# EAGLE schematic clock (EAGLE 6.2)
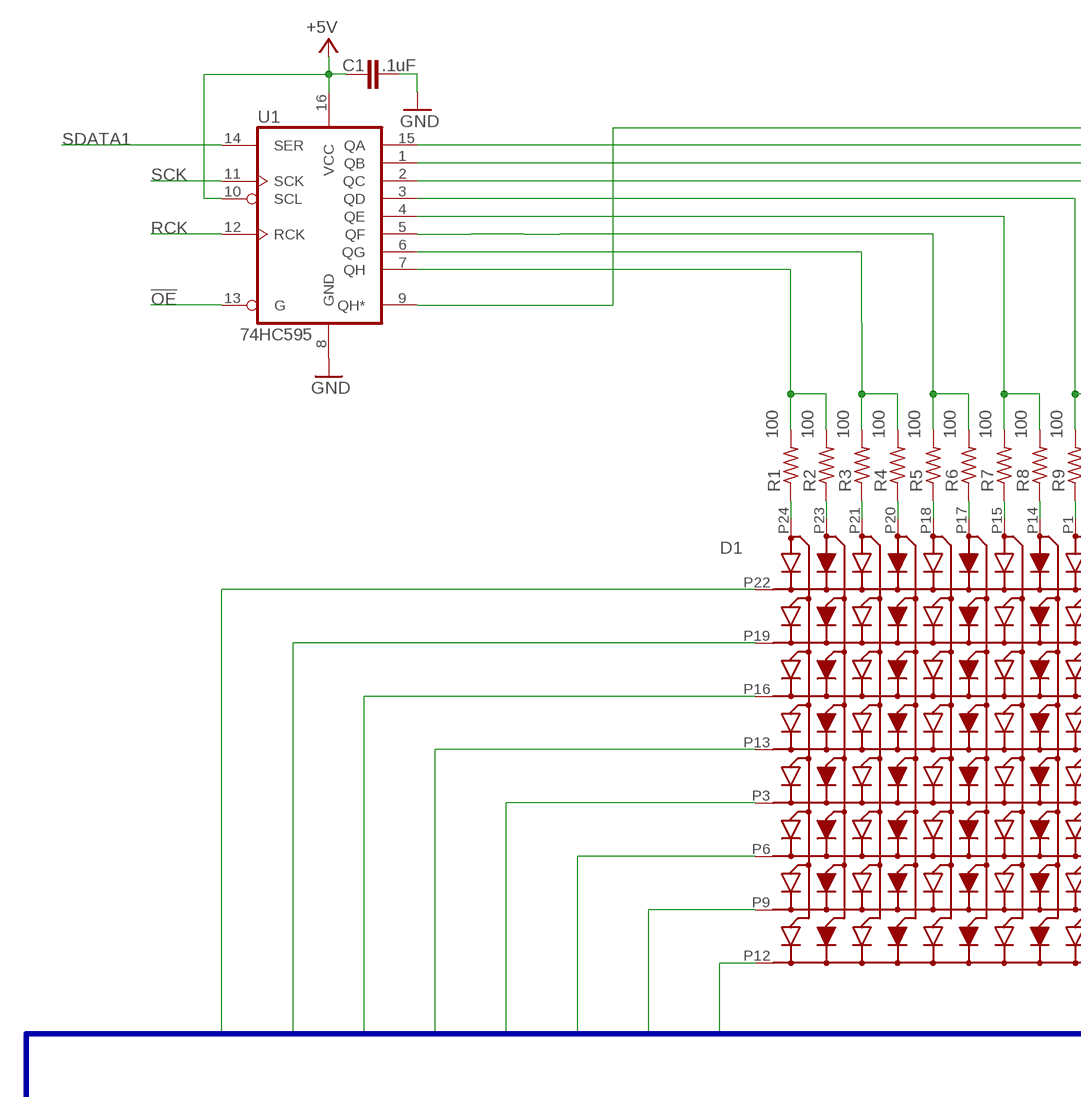
[diagram p0: schematic, sheet 1, part 1 of 3]
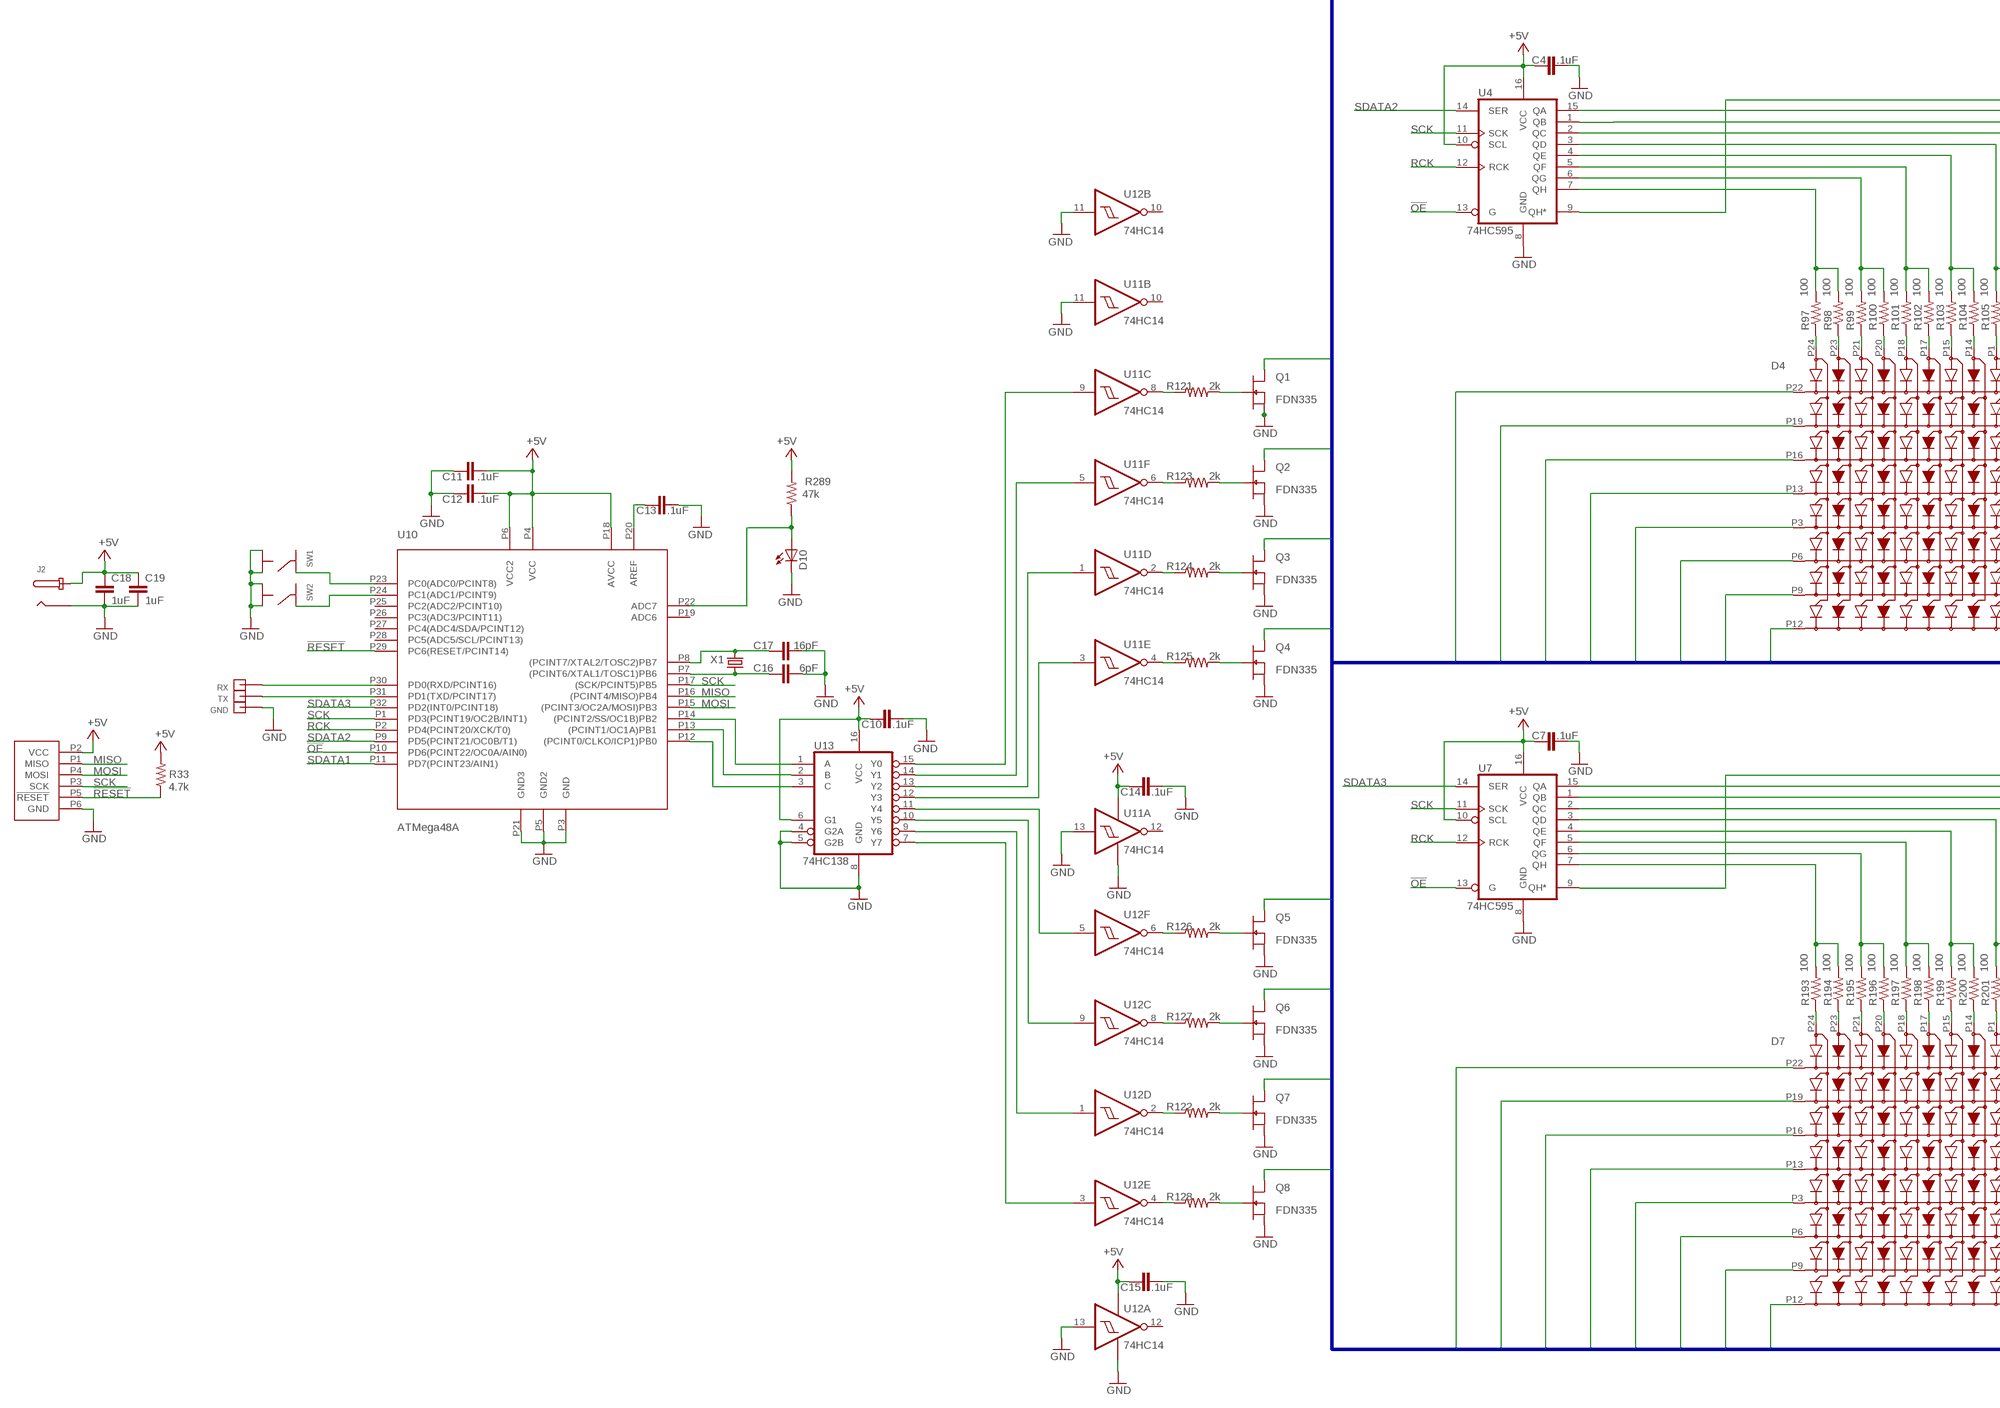
[diagram p1: schematic, sheet 1, part 2 of 3]
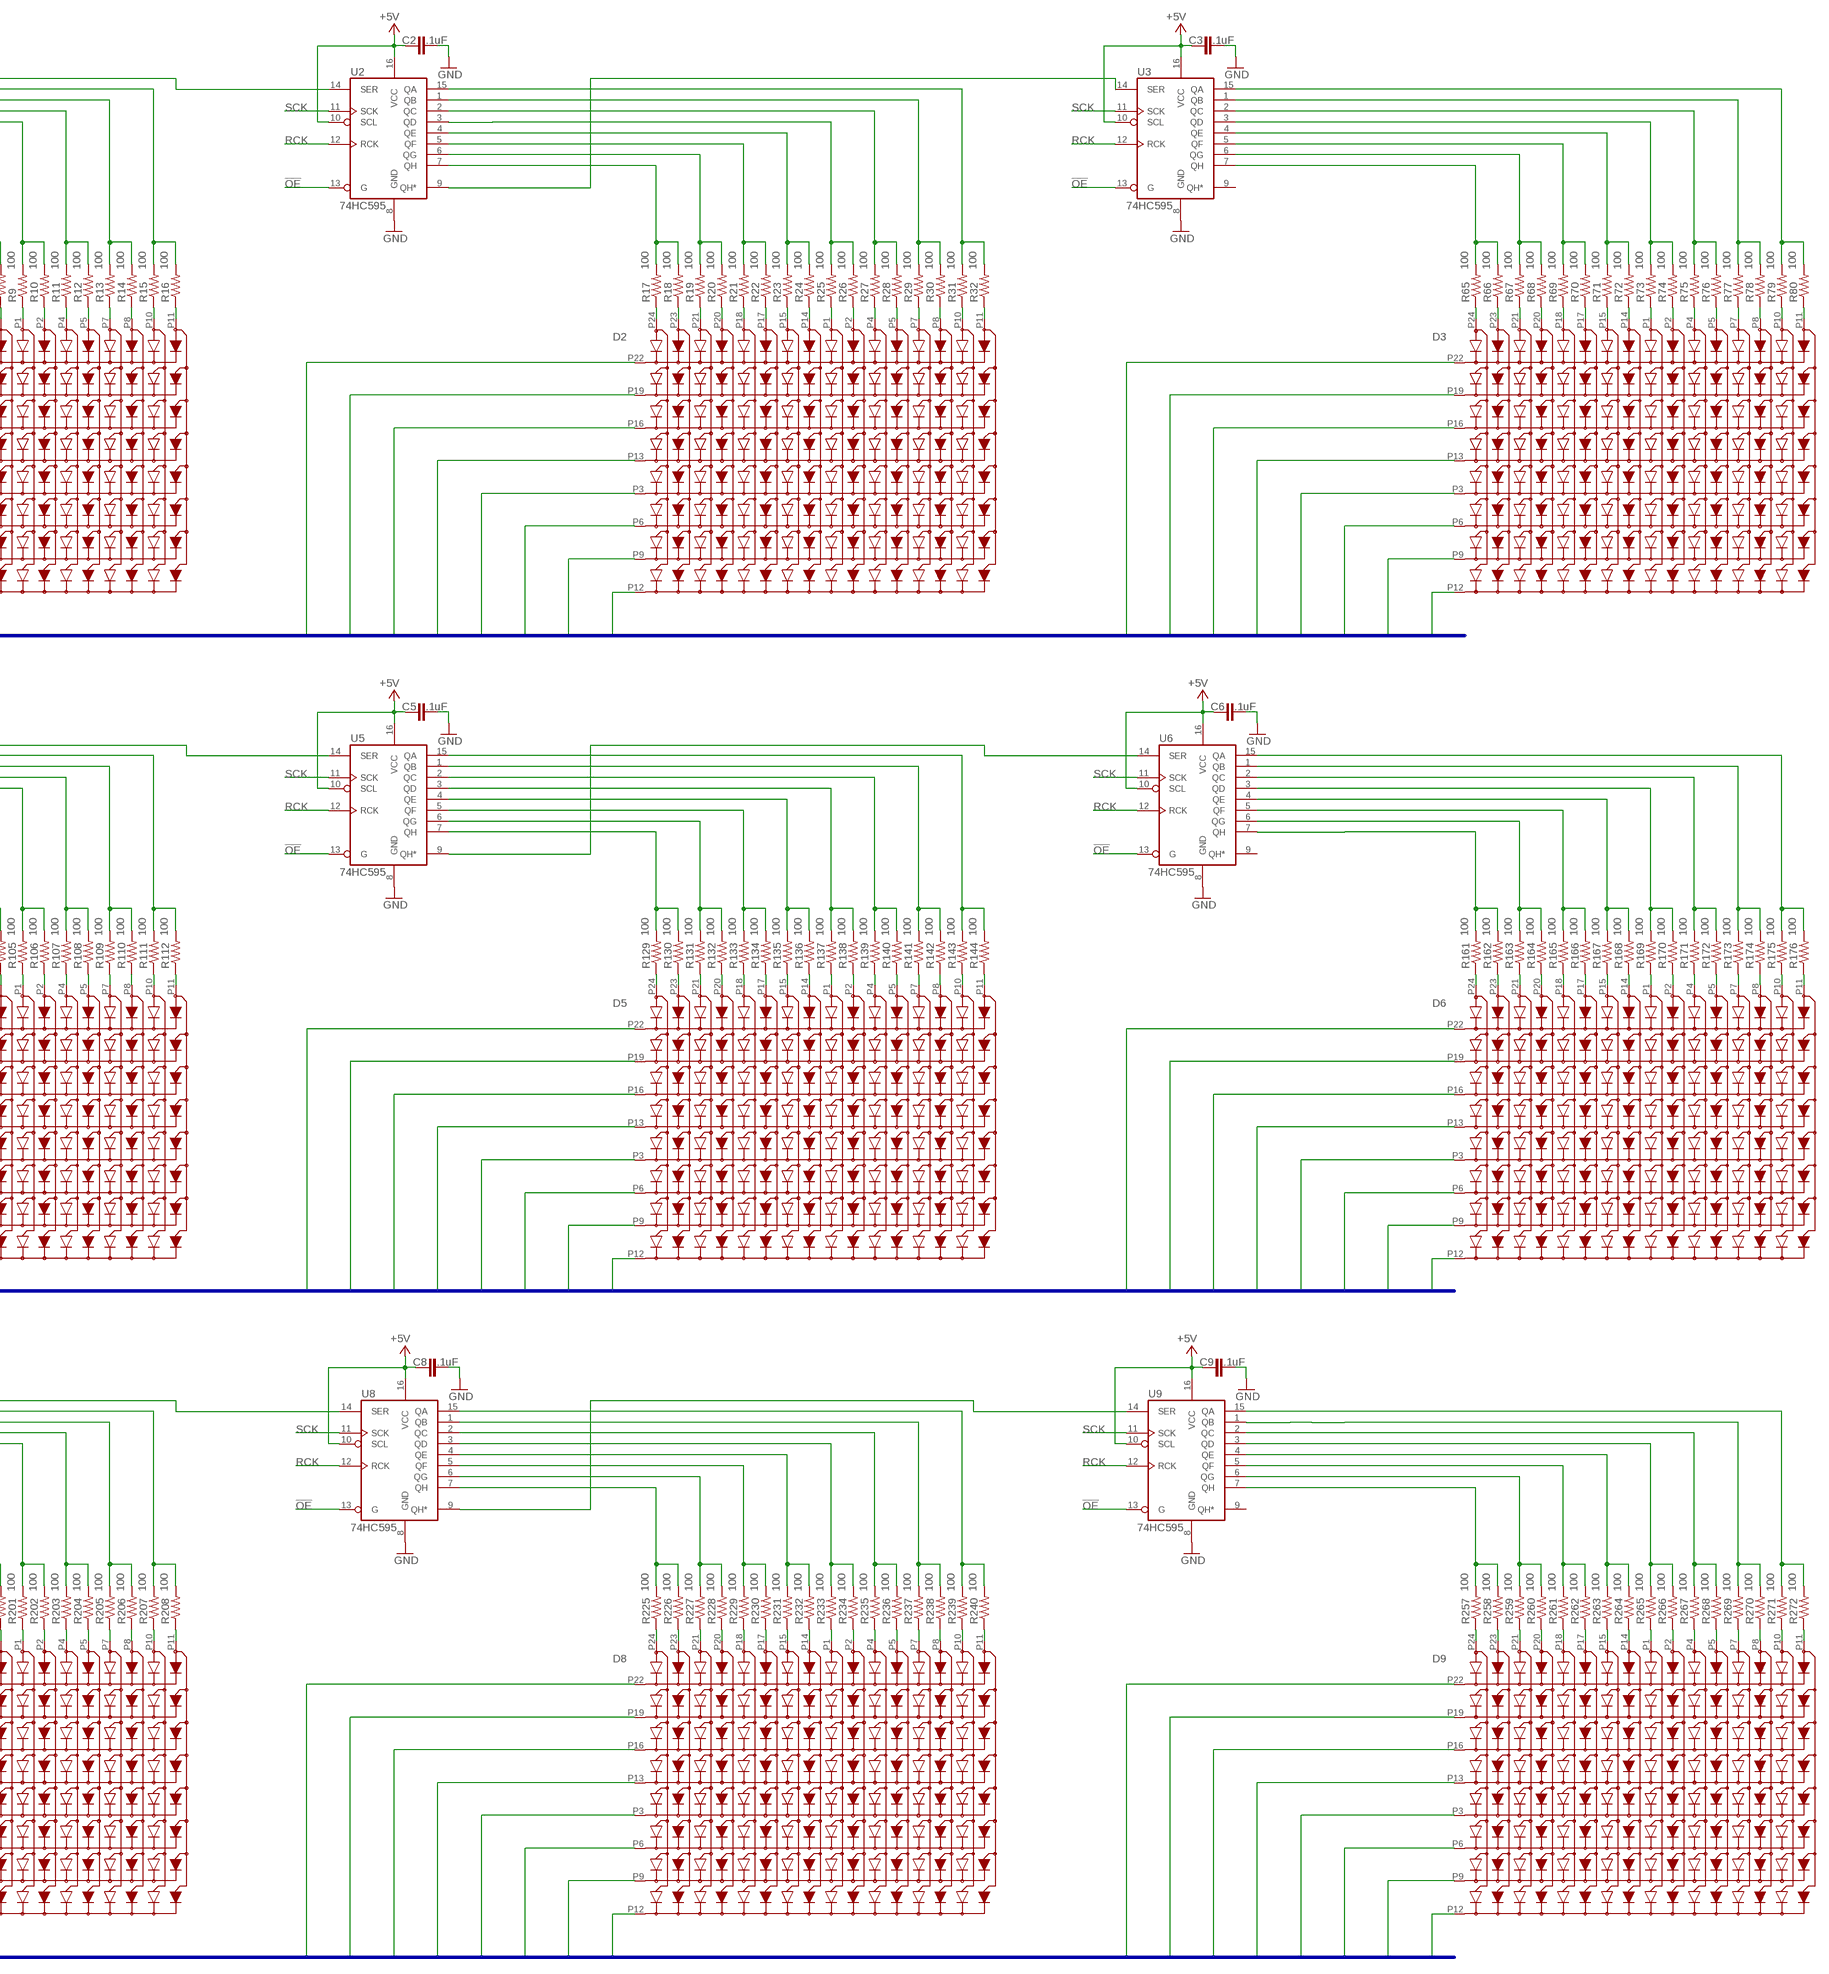
[diagram p2: schematic, sheet 1, part 3 of 3]

## Parts
C1  .1uF  CAPACITOR-.1UF  [0603/1608METRIC]
C2  .1uF  CAPACITOR-.1UF  [0603/1608METRIC]
C3  .1uF  CAPACITOR-.1UF  [0603/1608METRIC]
C4  .1uF  CAPACITOR-.1UF  [0603/1608METRIC]
C5  .1uF  CAPACITOR-.1UF  [0603/1608METRIC]
C6  .1uF  CAPACITOR-.1UF  [0603/1608METRIC]
C7  .1uF  CAPACITOR-.1UF  [0603/1608METRIC]
C8  .1uF  CAPACITOR-.1UF  [0603/1608METRIC]
C9  .1uF  CAPACITOR-.1UF  [0603/1608METRIC]
C10  .1uF  CAPACITOR-.1UF  [0603/1608METRIC]
C11  .1uF  CAPACITOR-.1UF  [0603/1608METRIC]
C12  .1uF  CAPACITOR-.1UF  [0603/1608METRIC]
C13  .1uF  CAPACITOR-.1UF  [0603/1608METRIC]
C14  .1uF  CAPACITOR-.1UF  [0603/1608METRIC]
C15  .1uF  CAPACITOR-.1UF  [0603/1608METRIC]
C16  6pF  CAPACITOR-6PF  [0603/1608METRIC]
C17  16pF  CAPACITOR-16PF  [0603/1608METRIC]
C18  1uF  CAPACITOR-1UF  [0603/1608METRIC]
C19  1uF  CAPACITOR-1UF  [0603/1608METRIC]
D1  BL-M12A883DUG-11"  [BL-M12A883DUG-11]
D2  BL-M12A883DUG-11"  [BL-M12A883DUG-11]
D3  BL-M12A883DUG-11"  [BL-M12A883DUG-11]
D4  BL-M12A883DUG-11"  [BL-M12A883DUG-11]
D5  BL-M12A883DUG-11"  [BL-M12A883DUG-11]
D6  BL-M12A883DUG-11"  [BL-M12A883DUG-11]
D7  BL-M12A883DUG-11"  [BL-M12A883DUG-11]
D8  BL-M12A883DUG-11"  [BL-M12A883DUG-11]
D9  BL-M12A883DUG-11"  [BL-M12A883DUG-11]
D10  TEPT4400  [LED3MM]
GND  HEADERPIN  [HEADERPIN]
J1  PROGHEADER-PINS  [ATMEL-PROGRAMMING-HEADER]
J2  DC-BARREL-JACK  [PJ-037A]
Q1  FDN335  [SOT23]
Q2  FDN335  [SOT23]
Q3  FDN335  [SOT23]
Q4  FDN335  [SOT23]
Q5  FDN335  [SOT23]
Q6  FDN335  [SOT23]
Q7  FDN335  [SOT23]
Q8  FDN335  [SOT23]
R1  100  RESISTOR-100-5%-0603  [0603/1608METRIC]
R2  100  RESISTOR-100-5%-0603  [0603/1608METRIC]
R3  100  RESISTOR-100-5%-0603  [0603/1608METRIC]
R4  100  RESISTOR-100-5%-0603  [0603/1608METRIC]
R5  100  RESISTOR-100-5%-0603  [0603/1608METRIC]
R6  100  RESISTOR-100-5%-0603  [0603/1608METRIC]
R7  100  RESISTOR-100-5%-0603  [0603/1608METRIC]
R8  100  RESISTOR-100-5%-0603  [0603/1608METRIC]
R9  100  RESISTOR-100-5%-0603  [0603/1608METRIC]
R10  100  RESISTOR-100-5%-0603  [0603/1608METRIC]
R11  100  RESISTOR-100-5%-0603  [0603/1608METRIC]
R12  100  RESISTOR-100-5%-0603  [0603/1608METRIC]
R13  100  RESISTOR-100-5%-0603  [0603/1608METRIC]
R14  100  RESISTOR-100-5%-0603  [0603/1608METRIC]
R15  100  RESISTOR-100-5%-0603  [0603/1608METRIC]
R16  100  RESISTOR-100-5%-0603  [0603/1608METRIC]
R17  100  RESISTOR-100-5%-0603  [0603/1608METRIC]
R18  100  RESISTOR-100-5%-0603  [0603/1608METRIC]
R19  100  RESISTOR-100-5%-0603  [0603/1608METRIC]
R20  100  RESISTOR-100-5%-0603  [0603/1608METRIC]
R21  100  RESISTOR-100-5%-0603  [0603/1608METRIC]
R22  100  RESISTOR-100-5%-0603  [0603/1608METRIC]
R23  100  RESISTOR-100-5%-0603  [0603/1608METRIC]
R24  100  RESISTOR-100-5%-0603  [0603/1608METRIC]
R25  100  RESISTOR-100-5%-0603  [0603/1608METRIC]
R26  100  RESISTOR-100-5%-0603  [0603/1608METRIC]
R27  100  RESISTOR-100-5%-0603  [0603/1608METRIC]
R28  100  RESISTOR-100-5%-0603  [0603/1608METRIC]
R29  100  RESISTOR-100-5%-0603  [0603/1608METRIC]
R30  100  RESISTOR-100-5%-0603  [0603/1608METRIC]
R31  100  RESISTOR-100-5%-0603  [0603/1608METRIC]
R32  100  RESISTOR-100-5%-0603  [0603/1608METRIC]
R33  4.7k  RESISTOR-4.7K-5%-0603  [0603/1608METRIC]
R65  100  RESISTOR-100-5%-0603  [0603/1608METRIC]
R66  100  RESISTOR-100-5%-0603  [0603/1608METRIC]
R67  100  RESISTOR-100-5%-0603  [0603/1608METRIC]
R68  100  RESISTOR-100-5%-0603  [0603/1608METRIC]
R69  100  RESISTOR-100-5%-0603  [0603/1608METRIC]
R70  100  RESISTOR-100-5%-0603  [0603/1608METRIC]
R71  100  RESISTOR-100-5%-0603  [0603/1608METRIC]
R72  100  RESISTOR-100-5%-0603  [0603/1608METRIC]
R73  100  RESISTOR-100-5%-0603  [0603/1608METRIC]
R74  100  RESISTOR-100-5%-0603  [0603/1608METRIC]
R75  100  RESISTOR-100-5%-0603  [0603/1608METRIC]
R76  100  RESISTOR-100-5%-0603  [0603/1608METRIC]
R77  100  RESISTOR-100-5%-0603  [0603/1608METRIC]
R78  100  RESISTOR-100-5%-0603  [0603/1608METRIC]
R79  100  RESISTOR-100-5%-0603  [0603/1608METRIC]
R80  100  RESISTOR-100-5%-0603  [0603/1608METRIC]
R97  100  RESISTOR-100-5%-0603  [0603/1608METRIC]
R98  100  RESISTOR-100-5%-0603  [0603/1608METRIC]
R99  100  RESISTOR-100-5%-0603  [0603/1608METRIC]
R100  100  RESISTOR-100-5%-0603  [0603/1608METRIC]
R101  100  RESISTOR-100-5%-0603  [0603/1608METRIC]
R102  100  RESISTOR-100-5%-0603  [0603/1608METRIC]
R103  100  RESISTOR-100-5%-0603  [0603/1608METRIC]
R104  100  RESISTOR-100-5%-0603  [0603/1608METRIC]
R105  100  RESISTOR-100-5%-0603  [0603/1608METRIC]
R106  100  RESISTOR-100-5%-0603  [0603/1608METRIC]
R107  100  RESISTOR-100-5%-0603  [0603/1608METRIC]
R108  100  RESISTOR-100-5%-0603  [0603/1608METRIC]
R109  100  RESISTOR-100-5%-0603  [0603/1608METRIC]
R110  100  RESISTOR-100-5%-0603  [0603/1608METRIC]
R111  100  RESISTOR-100-5%-0603  [0603/1608METRIC]
R112  100  RESISTOR-100-5%-0603  [0603/1608METRIC]
R121  2k  RESISTOR-2K-5%-0603  [0603/1608METRIC]
R122  2k  RESISTOR-2K-5%-0603  [0603/1608METRIC]
R123  2k  RESISTOR-2K-5%-0603  [0603/1608METRIC]
R124  2k  RESISTOR-2K-5%-0603  [0603/1608METRIC]
R125  2k  RESISTOR-2K-5%-0603  [0603/1608METRIC]
R126  2k  RESISTOR-2K-5%-0603  [0603/1608METRIC]
R127  2k  RESISTOR-2K-5%-0603  [0603/1608METRIC]
R128  2k  RESISTOR-2K-5%-0603  [0603/1608METRIC]
R129  100  RESISTOR-100-5%-0603  [0603/1608METRIC]
R130  100  RESISTOR-100-5%-0603  [0603/1608METRIC]
R131  100  RESISTOR-100-5%-0603  [0603/1608METRIC]
R132  100  RESISTOR-100-5%-0603  [0603/1608METRIC]
R133  100  RESISTOR-100-5%-0603  [0603/1608METRIC]
R134  100  RESISTOR-100-5%-0603  [0603/1608METRIC]
R135  100  RESISTOR-100-5%-0603  [0603/1608METRIC]
R136  100  RESISTOR-100-5%-0603  [0603/1608METRIC]
R137  100  RESISTOR-100-5%-0603  [0603/1608METRIC]
R138  100  RESISTOR-100-5%-0603  [0603/1608METRIC]
R139  100  RESISTOR-100-5%-0603  [0603/1608METRIC]
R140  100  RESISTOR-100-5%-0603  [0603/1608METRIC]
R141  100  RESISTOR-100-5%-0603  [0603/1608METRIC]
R142  100  RESISTOR-100-5%-0603  [0603/1608METRIC]
R143  100  RESISTOR-100-5%-0603  [0603/1608METRIC]
R144  100  RESISTOR-100-5%-0603  [0603/1608METRIC]
R161  100  RESISTOR-100-5%-0603  [0603/1608METRIC]
R162  100  RESISTOR-100-5%-0603  [0603/1608METRIC]
R163  100  RESISTOR-100-5%-0603  [0603/1608METRIC]
R164  100  RESISTOR-100-5%-0603  [0603/1608METRIC]
R165  100  RESISTOR-100-5%-0603  [0603/1608METRIC]
R166  100  RESISTOR-100-5%-0603  [0603/1608METRIC]
R167  100  RESISTOR-100-5%-0603  [0603/1608METRIC]
R168  100  RESISTOR-100-5%-0603  [0603/1608METRIC]
R169  100  RESISTOR-100-5%-0603  [0603/1608METRIC]
R170  100  RESISTOR-100-5%-0603  [0603/1608METRIC]
R171  100  RESISTOR-100-5%-0603  [0603/1608METRIC]
R172  100  RESISTOR-100-5%-0603  [0603/1608METRIC]
R173  100  RESISTOR-100-5%-0603  [0603/1608METRIC]
R174  100  RESISTOR-100-5%-0603  [0603/1608METRIC]
R175  100  RESISTOR-100-5%-0603  [0603/1608METRIC]
R176  100  RESISTOR-100-5%-0603  [0603/1608METRIC]
R193  100  RESISTOR-100-5%-0603  [0603/1608METRIC]
R194  100  RESISTOR-100-5%-0603  [0603/1608METRIC]
R195  100  RESISTOR-100-5%-0603  [0603/1608METRIC]
R196  100  RESISTOR-100-5%-0603  [0603/1608METRIC]
R197  100  RESISTOR-100-5%-0603  [0603/1608METRIC]
R198  100  RESISTOR-100-5%-0603  [0603/1608METRIC]
R199  100  RESISTOR-100-5%-0603  [0603/1608METRIC]
R200  100  RESISTOR-100-5%-0603  [0603/1608METRIC]
R201  100  RESISTOR-100-5%-0603  [0603/1608METRIC]
R202  100  RESISTOR-100-5%-0603  [0603/1608METRIC]
R203  100  RESISTOR-100-5%-0603  [0603/1608METRIC]
R204  100  RESISTOR-100-5%-0603  [0603/1608METRIC]
R205  100  RESISTOR-100-5%-0603  [0603/1608METRIC]
R206  100  RESISTOR-100-5%-0603  [0603/1608METRIC]
R207  100  RESISTOR-100-5%-0603  [0603/1608METRIC]
R208  100  RESISTOR-100-5%-0603  [0603/1608METRIC]
R225  100  RESISTOR-100-5%-0603  [0603/1608METRIC]
R226  100  RESISTOR-100-5%-0603  [0603/1608METRIC]
R227  100  RESISTOR-100-5%-0603  [0603/1608METRIC]
R228  100  RESISTOR-100-5%-0603  [0603/1608METRIC]
R229  100  RESISTOR-100-5%-0603  [0603/1608METRIC]
R230  100  RESISTOR-100-5%-0603  [0603/1608METRIC]
R231  100  RESISTOR-100-5%-0603  [0603/1608METRIC]
R232  100  RESISTOR-100-5%-0603  [0603/1608METRIC]
R233  100  RESISTOR-100-5%-0603  [0603/1608METRIC]
R234  100  RESISTOR-100-5%-0603  [0603/1608METRIC]
R235  100  RESISTOR-100-5%-0603  [0603/1608METRIC]
R236  100  RESISTOR-100-5%-0603  [0603/1608METRIC]
R237  100  RESISTOR-100-5%-0603  [0603/1608METRIC]
R238  100  RESISTOR-100-5%-0603  [0603/1608METRIC]
R239  100  RESISTOR-100-5%-0603  [0603/1608METRIC]
R240  100  RESISTOR-100-5%-0603  [0603/1608METRIC]
R257  100  RESISTOR-100-5%-0603  [0603/1608METRIC]
R258  100  RESISTOR-100-5%-0603  [0603/1608METRIC]
R259  100  RESISTOR-100-5%-0603  [0603/1608METRIC]
R260  100  RESISTOR-100-5%-0603  [0603/1608METRIC]
R261  100  RESISTOR-100-5%-0603  [0603/1608METRIC]
R262  100  RESISTOR-100-5%-0603  [0603/1608METRIC]
R263  100  RESISTOR-100-5%-0603  [0603/1608METRIC]
R264  100  RESISTOR-100-5%-0603  [0603/1608METRIC]
R265  100  RESISTOR-100-5%-0603  [0603/1608METRIC]
R266  100  RESISTOR-100-5%-0603  [0603/1608METRIC]
R267  100  RESISTOR-100-5%-0603  [0603/1608METRIC]
R268  100  RESISTOR-100-5%-0603  [0603/1608METRIC]
R269  100  RESISTOR-100-5%-0603  [0603/1608METRIC]
R270  100  RESISTOR-100-5%-0603  [0603/1608METRIC]
R271  100  RESISTOR-100-5%-0603  [0603/1608METRIC]
R272  100  RESISTOR-100-5%-0603  [0603/1608METRIC]
R289  47k  RESISTOR-47K-5%-0603  [0603/1608METRIC]
RX  HEADERPIN  [HEADERPIN]
SW1  4mm  SWITCH-TACT-TH  [FSM16JHSWITCH]
SW2  4mm  SWITCH-TACT-TH  [FSM16JHSWITCH]
TX  HEADERPIN  [HEADERPIN]
U1  74HC595  74HC595-SOIC  [SO16]
U2  74HC595  74HC595-SOIC  [SO16]
U3  74HC595  74HC595-SOIC  [SO16]
U4  74HC595  74HC595-SOIC  [SO16]
U5  74HC595  74HC595-SOIC  [SO16]
U6  74HC595  74HC595-SOIC  [SO16]
U7  74HC595  74HC595-SOIC  [SO16]
U8  74HC595  74HC595-SOIC  [SO16]
U9  74HC595  74HC595-SOIC  [SO16]
U10  ATMega48A  ATMEGA48A  [TQFP-32]
U11  74HC14  74HC14-SOIC  [SO14]
U12  74HC14  74HC14-SOIC  [SO14]
U13  74HC138  74HC138-SOIC  [SO16]
X1  XTAL  [AB38T]

## Nets
!OE: U1.13(G) U2.13(G) U3.13(G) U4.13(G) U5.13(G) U6.13(G) U7.13(G) U8.13(G) U9.13(G) U10.P10(PD6(PCINT22/OC0A/AIN0))
!RESET: J1.P5(!RESET) R33.P1 U10.P29(PC6(RESET/PCINT14))
+5V: C1.P1 C2.P1 C3.P1 C4.P1 C5.P1 C6.P1 C7.P1 C8.P1 C9.P1 C10.P1 C11.P1 C12.P1 C14.P1 C15.P1 C18.P1 C19.P1 J1.P2(VCC) J2.PIN R33.P2 R289.P2 U1.10(SCL) U1.16(VCC) U2.10(SCL) U2.16(VCC) U3.10(SCL) U3.16(VCC) U4.10(SCL) U4.16(VCC) U5.10(SCL) U5.16(VCC) U6.10(SCL) U6.16(VCC) U7.10(SCL) U7.16(VCC) U8.10(SCL) U8.16(VCC) U9.10(SCL) U9.16(VCC) U10.P4(VCC) U10.P6(VCC2) U10.P18(AVCC) U11.14(A:VCC) U12.14(A:VCC) U13.6(G1) U13.16(VCC)
GND: C1.P2 C2.P2 C3.P2 C4.P2 C5.P2 C6.P2 C7.P2 C8.P2 C9.P2 C10.P2 C11.P2 C12.P2 C13.P2 C14.P2 C15.P2 C16.P2 C17.P2 C18.P2 C19.P2 D10.K(C) GND.P$1 J1.P6(GND) J2.BARREL Q1.2(S) Q2.2(S) Q3.2(S) Q4.2(S) Q5.2(S) Q6.2(S) Q7.2(S) Q8.2(S) SW1.P3 SW1.P4 SW2.P3 SW2.P4 U1.8(GND) U2.8(GND) U3.8(GND) U4.8(GND) U5.8(GND) U6.8(GND) U7.8(GND) U8.8(GND) U9.8(GND) U10.P3(GND) U10.P5(GND2) U10.P21(GND3) U11.7(A:GND) U11.11(B:I) U11.13(A:I) U12.7(A:GND) U12.11(B:I) U12.13(A:I) U13.4(G2A) U13.5(G2B) U13.8(GND)
MISO: J1.P1(MISO) U10.P16((PCINT4/MISO)PB4)
MOSI: J1.P4(MOSI) U10.P15((PCINT3/OC2A/MOSI)PB3)
N$1: D1.P24(C1G) R1.P1
N$2: D1.P23(C1R) R2.P1
N$3: D1.P21(C2G) R3.P1
N$4: D1.P20(C2R) R4.P1
N$5: D1.P18(C3G) R5.P1
N$6: D1.P17(C3R) R6.P1
N$7: D1.P15(C4G) R7.P1
N$8: D1.P14(C4R) R8.P1
N$9: D1.P1(C5G) R9.P1
N$10: D1.P2(C5R) R10.P1
N$11: D1.P4(C6G) R11.P1
N$12: D1.P5(C6R) R12.P1
N$13: D1.P7(C7G) R13.P1
N$14: D1.P8(C7R) R14.P1
N$15: D1.P10(C8G) R15.P1
N$16: D1.P11(C8R) R16.P1
N$17: U11.9(C:I) U13.15(Y0)
N$18: D2.P24(C1G) R17.P1
N$19: D2.P23(C1R) R18.P1
N$20: D2.P21(C2G) R19.P1
N$21: D2.P20(C2R) R20.P1
N$22: D2.P18(C3G) R21.P1
N$23: D2.P17(C3R) R22.P1
N$24: D2.P15(C4G) R23.P1
N$25: D2.P14(C4R) R24.P1
N$26: D2.P1(C5G) R25.P1
N$27: D2.P2(C5R) R26.P1
N$28: D2.P4(C6G) R27.P1
N$29: D2.P5(C6R) R28.P1
N$30: D2.P7(C7G) R29.P1
N$31: D2.P8(C7R) R30.P1
N$32: D2.P10(C8G) R31.P1
N$33: R124.P1 U11.2(D:O)
N$34: R123.P1 U11.6(F:O)
N$35: R121.P1 U11.8(C:O)
N$36: R125.P1 U11.4(E:O)
N$37: R128.P1 U12.4(E:O)
N$38: R122.P1 U12.2(D:O)
N$39: R127.P1 U12.8(C:O)
N$40: R126.P1 U12.6(F:O)
N$41: C16.P1 U10.P7((PCINT6/XTAL1/TOSC1)PB6) X1.P$1
N$42: R3.P2 R4.P2 U1.6(QG)
N$43: TX.P$1 U10.P31(PD1(TXD/PCINT17))
N$44: C17.P1 U10.P8((PCINT7/XTAL2/TOSC2)PB7) X1.P$2
N$45: RX.P$1 U10.P30(PD0(RXD/PCINT16))
N$46: Q3.1(G) R124.P2
N$47: SW2.P2 U10.P24(PC1(ADC1/PCINT9))
N$48: SW1.P2 U10.P23(PC0(ADC0/PCINT8))
N$49: R1.P2 R2.P2 U1.7(QH)
N$50: Q1.1(G) R121.P2
N$51: R5.P2 R6.P2 U1.5(QF)
N$52: R7.P2 R8.P2 U1.4(QE)
N$53: R9.P2 R10.P2 U1.3(QD)
N$54: R11.P2 R12.P2 U1.2(QC)
N$55: R13.P2 R14.P2 U1.1(QB)
N$56: R15.P2 R16.P2 U1.15(QA)
N$74: U11.5(F:I) U13.14(Y1)
N$75: U4.9(QH*) U5.14(SER)
N$76: U5.9(QH*) U6.14(SER)
N$77: U11.1(D:I) U13.13(Y2)
N$78: U1.9(QH*) U2.14(SER)
N$79: U2.9(QH*) U3.14(SER)
N$80: D2.P11(C8R) R32.P1
N$84: R25.P2 R26.P2 U2.3(QD)
N$85: R23.P2 R24.P2 U2.4(QE)
N$87: R19.P2 R20.P2 U2.6(QG)
N$97: R17.P2 R18.P2 U2.7(QH)
N$99: R21.P2 R22.P2 U2.5(QF)
N$102: R27.P2 R28.P2 U2.2(QC)
N$103: R29.P2 R30.P2 U2.1(QB)
N$104: R31.P2 R32.P2 U2.15(QA)
N$121: U7.9(QH*) U8.14(SER)
N$122: U8.9(QH*) U9.14(SER)
N$123: U11.3(E:I) U13.12(Y3)
N$124: U12.5(F:I) U13.11(Y4)
N$125: U12.9(C:I) U13.10(Y5)
N$126: U12.1(D:I) U13.9(Y6)
N$127: U12.3(E:I) U13.7(Y7)
N$128: D10.A R289.P1 U10.P22(ADC7)
N$129: D3.P24(C1G) R65.P1
N$130: D3.P23(C1R) R66.P1
N$131: D3.P21(C2G) R67.P1
N$132: D3.P20(C2R) R68.P1
N$133: D3.P18(C3G) R69.P1
N$134: D3.P17(C3R) R70.P1
N$135: D3.P15(C4G) R71.P1
N$136: D3.P14(C4R) R72.P1
N$137: D3.P1(C5G) R73.P1
N$138: D3.P2(C5R) R74.P1
N$139: D3.P4(C6G) R75.P1
N$140: D3.P5(C6R) R76.P1
N$141: D3.P7(C7G) R77.P1
N$142: D3.P8(C7R) R78.P1
N$143: D3.P10(C8G) R79.P1
N$144: D3.P11(C8R) R80.P1
N$161: R65.P2 R66.P2 U3.7(QH)
N$162: R67.P2 R68.P2 U3.6(QG)
N$163: R69.P2 R70.P2 U3.5(QF)
N$164: R71.P2 R72.P2 U3.4(QE)
N$165: R73.P2 R74.P2 U3.3(QD)
N$166: R75.P2 R76.P2 U3.2(QC)
N$167: R77.P2 R78.P2 U3.1(QB)
N$168: R79.P2 R80.P2 U3.15(QA)
N$185: U10.P12((PCINT0/CLKO/ICP1)PB0) U13.3(C)
N$186: U10.P13((PCINT1/OC1A)PB1) U13.2(B)
N$187: U10.P14((PCINT2/SS/OC1B)PB2) U13.1(A)
N$188: C13.P1 U10.P20(AREF)
N$193: D4.P24(C1G) R97.P1
N$194: D4.P23(C1R) R98.P1
N$195: D4.P21(C2G) R99.P1
N$196: D4.P20(C2R) R100.P1
N$197: D4.P18(C3G) R101.P1
N$198: D4.P17(C3R) R102.P1
N$199: D4.P15(C4G) R103.P1
N$200: D4.P14(C4R) R104.P1
N$201: D4.P1(C5G) R105.P1
N$202: D4.P2(C5R) R106.P1
N$203: D4.P4(C6G) R107.P1
N$204: D4.P5(C6R) R108.P1
N$205: D4.P7(C7G) R109.P1
N$206: D4.P8(C7R) R110.P1
N$207: D4.P10(C8G) R111.P1
N$208: D4.P11(C8R) R112.P1
N$210: R109.P2 R110.P2 U4.1(QB)
N$225: R97.P2 R98.P2 U4.7(QH)
N$226: R99.P2 R100.P2 U4.6(QG)
N$227: R101.P2 R102.P2 U4.5(QF)
N$228: R103.P2 R104.P2 U4.4(QE)
N$229: R105.P2 R106.P2 U4.3(QD)
N$230: R107.P2 R108.P2 U4.2(QC)
N$232: R111.P2 R112.P2 U4.15(QA)
N$242: Q7.1(G) R122.P2
N$243: Q2.1(G) R123.P2
N$245: Q4.1(G) R125.P2
N$246: Q5.1(G) R126.P2
N$247: Q6.1(G) R127.P2
N$248: Q8.1(G) R128.P2
N$252: D5.P24(C1G) R129.P1
N$253: D5.P23(C1R) R130.P1
N$254: D5.P21(C2G) R131.P1
N$255: D5.P20(C2R) R132.P1
N$256: D5.P18(C3G) R133.P1
N$257: D5.P17(C3R) R134.P1
N$258: D5.P15(C4G) R135.P1
N$259: D5.P14(C4R) R136.P1
N$260: D5.P1(C5G) R137.P1
N$261: D5.P2(C5R) R138.P1
N$262: D5.P4(C6G) R139.P1
N$263: D5.P5(C6R) R140.P1
N$264: D5.P7(C7G) R141.P1
N$265: D5.P8(C7R) R142.P1
N$266: D5.P10(C8G) R143.P1
N$267: D5.P11(C8R) R144.P1
N$284: R129.P2 R130.P2 U5.7(QH)
N$285: R131.P2 R132.P2 U5.6(QG)
N$286: R133.P2 R134.P2 U5.5(QF)
N$287: R135.P2 R136.P2 U5.4(QE)
N$288: R137.P2 R138.P2 U5.3(QD)
N$289: R139.P2 R140.P2 U5.2(QC)
N$290: R141.P2 R142.P2 U5.1(QB)
N$291: R143.P2 R144.P2 U5.15(QA)
N$308: D6.P24(C1G) R161.P1
N$309: D6.P23(C1R) R162.P1
N$310: D6.P21(C2G) R163.P1
N$311: D6.P20(C2R) R164.P1
N$312: D6.P18(C3G) R165.P1
N$313: D6.P17(C3R) R166.P1
N$314: D6.P15(C4G) R167.P1
N$315: D6.P14(C4R) R168.P1
N$316: D6.P1(C5G) R169.P1
N$317: D6.P2(C5R) R170.P1
N$318: D6.P4(C6G) R171.P1
N$319: D6.P5(C6R) R172.P1
N$320: D6.P7(C7G) R173.P1
N$321: D6.P8(C7R) R174.P1
N$322: D6.P10(C8G) R175.P1
N$323: D6.P11(C8R) R176.P1
N$331: R161.P2 R162.P2 U6.7(QH)
N$341: R163.P2 R164.P2 U6.6(QG)
N$342: R165.P2 R166.P2 U6.5(QF)
N$343: R167.P2 R168.P2 U6.4(QE)
N$344: R169.P2 R170.P2 U6.3(QD)
N$345: R171.P2 R172.P2 U6.2(QC)
N$346: R173.P2 R174.P2 U6.1(QB)
N$347: R175.P2 R176.P2 U6.15(QA)
N$369: D7.P24(C1G) R193.P1
N$370: D7.P23(C1R) R194.P1
N$371: D7.P21(C2G) R195.P1
N$372: D7.P20(C2R) R196.P1
N$373: D7.P18(C3G) R197.P1
N$374: D7.P17(C3R) R198.P1
N$375: D7.P15(C4G) R199.P1
N$376: D7.P14(C4R) R200.P1
N$377: D7.P1(C5G) R201.P1
N$378: D7.P2(C5R) R202.P1
N$379: D7.P4(C6G) R203.P1
N$380: D7.P5(C6R) R204.P1
N$381: D7.P7(C7G) R205.P1
N$382: D7.P8(C7R) R206.P1
N$383: D7.P10(C8G) R207.P1
N$384: D7.P11(C8R) R208.P1
N$401: R193.P2 R194.P2 U7.7(QH)
N$402: R195.P2 R196.P2 U7.6(QG)
N$403: R197.P2 R198.P2 U7.5(QF)
N$404: R199.P2 R200.P2 U7.4(QE)
N$405: R201.P2 R202.P2 U7.3(QD)
N$406: R203.P2 R204.P2 U7.2(QC)
N$407: R205.P2 R206.P2 U7.1(QB)
N$408: R207.P2 R208.P2 U7.15(QA)
N$428: D8.P24(C1G) R225.P1
N$429: D8.P23(C1R) R226.P1
N$430: D8.P21(C2G) R227.P1
N$431: D8.P20(C2R) R228.P1
N$432: D8.P18(C3G) R229.P1
N$433: D8.P17(C3R) R230.P1
N$434: D8.P15(C4G) R231.P1
N$435: D8.P14(C4R) R232.P1
N$436: D8.P1(C5G) R233.P1
N$437: D8.P2(C5R) R234.P1
N$438: D8.P4(C6G) R235.P1
N$439: D8.P5(C6R) R236.P1
N$440: D8.P7(C7G) R237.P1
N$441: D8.P8(C7R) R238.P1
N$442: D8.P10(C8G) R239.P1
N$443: D8.P11(C8R) R240.P1
N$460: R225.P2 R226.P2 U8.7(QH)
N$461: R227.P2 R228.P2 U8.6(QG)
N$462: R229.P2 R230.P2 U8.5(QF)
N$463: R231.P2 R232.P2 U8.4(QE)
N$464: R233.P2 R234.P2 U8.3(QD)
N$465: R235.P2 R236.P2 U8.2(QC)
N$466: R237.P2 R238.P2 U8.1(QB)
N$467: R239.P2 R240.P2 U8.15(QA)
N$484: D9.P24(C1G) R257.P1
N$485: D9.P23(C1R) R258.P1
N$486: D9.P21(C2G) R259.P1
N$487: D9.P20(C2R) R260.P1
N$488: D9.P18(C3G) R261.P1
N$489: D9.P17(C3R) R262.P1
N$490: D9.P15(C4G) R263.P1
N$491: D9.P14(C4R) R264.P1
N$492: D9.P1(C5G) R265.P1
N$493: D9.P2(C5R) R266.P1
N$494: D9.P4(C6G) R267.P1
N$495: D9.P5(C6R) R268.P1
N$496: D9.P7(C7G) R269.P1
N$497: D9.P8(C7R) R270.P1
N$498: D9.P10(C8G) R271.P1
N$499: D9.P11(C8R) R272.P1
N$501: R269.P2 R270.P2 U9.1(QB)
N$516: R257.P2 R258.P2 U9.7(QH)
N$517: R259.P2 R260.P2 U9.6(QG)
N$518: R261.P2 R262.P2 U9.5(QF)
N$519: R263.P2 R264.P2 U9.4(QE)
N$520: R265.P2 R266.P2 U9.3(QD)
N$521: R267.P2 R268.P2 U9.2(QC)
N$523: R271.P2 R272.P2 U9.15(QA)
RCK: U1.12(RCK) U2.12(RCK) U3.12(RCK) U4.12(RCK) U5.12(RCK) U6.12(RCK) U7.12(RCK) U8.12(RCK) U9.12(RCK) U10.P2(PD4(PCINT20/XCK/T0))
ROW0: D1.P22(R1) D2.P22(R1) D3.P22(R1) D4.P22(R1) D5.P22(R1) D6.P22(R1) D7.P22(R1) D8.P22(R1) D9.P22(R1) Q1.3(D)
ROW1: D1.P19(R2) D2.P19(R2) D3.P19(R2) D4.P19(R2) D5.P19(R2) D6.P19(R2) D7.P19(R2) D8.P19(R2) D9.P19(R2) Q2.3(D)
ROW2: D1.P16(R3) D2.P16(R3) D3.P16(R3) D4.P16(R3) D5.P16(R3) D6.P16(R3) D7.P16(R3) D8.P16(R3) D9.P16(R3) Q3.3(D)
ROW3: D1.P13(R4) D2.P13(R4) D3.P13(R4) D4.P13(R4) D5.P13(R4) D6.P13(R4) D7.P13(R4) D8.P13(R4) D9.P13(R4) Q4.3(D)
ROW4: D1.P3(R5) D2.P3(R5) D3.P3(R5) D4.P3(R5) D5.P3(R5) D6.P3(R5) D7.P3(R5) D8.P3(R5) D9.P3(R5) Q5.3(D)
ROW5: D1.P6(R6) D2.P6(R6) D3.P6(R6) D4.P6(R6) D5.P6(R6) D6.P6(R6) D7.P6(R6) D8.P6(R6) D9.P6(R6) Q6.3(D)
ROW6: D1.P9(R7) D2.P9(R7) D3.P9(R7) D4.P9(R7) D5.P9(R7) D6.P9(R7) D7.P9(R7) D8.P9(R7) D9.P9(R7) Q7.3(D)
ROW7: D1.P12(R8) D2.P12(R8) D3.P12(R8) D4.P12(R8) D5.P12(R8) D6.P12(R8) D7.P12(R8) D8.P12(R8) D9.P12(R8) Q8.3(D)
SCK: J1.P3(SCK) U1.11(SCK) U2.11(SCK) U3.11(SCK) U4.11(SCK) U5.11(SCK) U6.11(SCK) U7.11(SCK) U8.11(SCK) U9.11(SCK) U10.P1(PD3(PCINT19/OC2B/INT1)) U10.P17((SCK/PCINT5)PB5)
SDATA1: U1.14(SER) U10.P11(PD7(PCINT23/AIN1))
SDATA2: U4.14(SER) U10.P9(PD5(PCINT21/OC0B/T1))
SDATA3: U7.14(SER) U10.P32(PD2(INT0/PCINT18))
Unconnected: SW1.P1 SW2.P1 U3.9(QH*) U6.9(QH*) U9.9(QH*) U10.P19(ADC6) U10.P25(PC2(ADC2/PCINT10)) U10.P26(PC3(ADC3/PCINT11)) U10.P27(PC4(ADC4/SDA/PCINT12)) U10.P28(PC5(ADC5/SCL/PCINT13)) U11.10(B:O) U11.12(A:O) U12.10(B:O) U12.12(A:O)

## Buses
ROW[0..7]

## Library data of the parts
C1-C15 = ciuffocapacitor:CAPACITOR-*: Capacitor; DISTRIBUTOR: Digikey; DISTRIBUTORPARTNO: 478-1239-1-ND; MANUFACTURER: AVX Corporation; MNT-TYPE: SM; NO-PINS: 2; PACKAGE: 0603 (1608 Metric); TOLERANCE: 10%
C16 = ciuffocapacitor:CAPACITOR-*: Capacitor; DESCRIPTION: CAP CER 6PF 50V NP0 0603; DISTRIBUTOR: Digikey; DISTRIBUTORPARTNO: 445-5036-1-ND; MANUFACTURER: TDK Corporation; MNT-TYPE: SM; NO-PINS: 2; PACKAGE: 0603 (1608 Metric); TOLERANCE: 5%
C17 = ciuffocapacitor:CAPACITOR-*: Capacitor; DESCRIPTION: CAP CER 16PF 50V 5% NP0 0603; DISTRIBUTOR: Digikey; DISTRIBUTORPARTNO: 445-5051-1-ND; MANUFACTURER: TDK Corporation; MNT-TYPE: SM; NO-PINS: 2; PACKAGE: 0603 (1608 Metric); TOLERANCE: 5%
C18 C19 = ciuffocapacitor:CAPACITOR-*: Capacitor; DISTRIBUTOR: Digikey; DISTRIBUTORPARTNO: 445-1328-1-ND; MANUFACTURER: TDK CORPORATION; MNT-TYPE: SM; NO-PINS: 2; PACKAGE: 0603 (1608 Metric); TOLERANCE: 20%; VOLTAGE: 10V
D1-D9 = ciuffoLED:BL-M12A883DUG-11: 8X8 Red Green LED matrix display. Common cathode. 24 pin through hole; DISTRIBUTOR: ADAFRUIT; DISTRIBUTORPARTNO: 458; MANPARTNO: BL-M12A883DUG-11; MANUFACTURER: BETLUX; MNT-TYPE: TH; NO-PINS: 24
D10 = ciuffodiscrete:TEPT4400: Photo Transistor; DISTRIBUTOR: Digikey; DISTRIBUTORPARTNO: 751-1057-ND; MANPARTNO: TEPT4400; MANUFACTURER: Vishay Semiconductors; MNT-TYPE: TH; PACKAGE: 3MMLED
GND RX TX = ciuffomisc:HEADERPIN: .031" PIN
J1 = ciuffomisc:PROGHEADER; DESCRIPTION: CONN HEADER 100POS .100" DL TIN; DISTRIBUTOR: Digikey; DISTRIBUTORPARTNO: xxSAM1048-50-NDxx; MANPARTNO: TSW-150-08-T-D; MANUFACTURER: Samtec Inc.; MNT-TYPE: TH; NO-PINS: 6
J2 = ciuffomisc:DC-BARREL-JACK; DESCRIPTION: CON PWR JCK 2.0 X 6.5MM W/O SW; DISTRIBUTOR: Digikey; DISTRIBUTORPARTNO: CP-037A-ND; MANPARTNO: PJ-037A; MANUFACTURER: CUI Inc; MNT-TYPE: TH; NO-PINS: 2
Q1-Q8 = ciuffodiscrete:FDN335: SOT-23 N CHANNEL MOSFET NFET; DESCRIPTION: MOSFET N-CH 20V 1.7A SSOT3; DISTRIBUTOR: Digikey; DISTRIBUTORPARTNO: FDN335NCT-ND; MANPARTNO: FDN335N; MANUFACTURER: Fairchild Semiconductor; MNT-TYPE: SMT; NO-PINS: 3; PACKAGE: SOT23
R1-R32 R65-R80 R97-R112 R129-R144 R161-R176 R193-R208 R225-R240 R257-R272 = ciufforesistor:RESISTOR-*-5%-: Resistor; DISTRIBUTOR: Digikey; DISTRIBUTORPARTNO: 311-100GRCT-ND; MANPARTNO: RC0603JR-07100RL; MANUFACTURER: Yaego; MNT-TYPE: SM; NO-PINS: 2; PACKAGE: 0603 (1608 Metric); TOLERANCE: 5%
R33 = ciufforesistor:RESISTOR-*-5%-: Resistor; DISTRIBUTOR: Digikey; DISTRIBUTORPARTNO: 311-4.7kGRCT-ND; MANPARTNO: RC0603JR-074K7L; MANUFACTURER: Yaego; MNT-TYPE: SM; NO-PINS: 2; PACKAGE: 0603 (1608 Metric); TOLERANCE: 5%
R121-R128 = ciufforesistor:RESISTOR-*-5%-: Resistor; DISTRIBUTOR: Digikey; DISTRIBUTORPARTNO: 311-2.0KGRCT-ND; MANPARTNO: RC0603JR-072KL; MANUFACTURER: Yaego; MNT-TYPE: SM; NO-PINS: 2; PACKAGE: 0603 (1608 Metric); TOLERANCE: 5%
R289 = ciufforesistor:RESISTOR-*-5%-: Resistor; DISTRIBUTOR: Digikey; DISTRIBUTORPARTNO: 311-47KGRCT-ND; MANPARTNO: RC0603JR-0747KL; MANUFACTURER: Yaego; MNT-TYPE: SM; NO-PINS: 2; PACKAGE: 0603 (1608 Metric); TOLERANCE: 5%
SW1 SW2 = ciuffomisc:SWITCH-TACT-TH: Tactile switch; DISTRIBUTOR: Digikey; DISTRIBUTORPARTNO: 450-1650-ND; MANPARTNO: FSM4JH; MANUFACTURER: TE Connectivity; MNT-TYPE: TH; NO-PINS: 4
U1-U9 = ciuffoIC:74*595: 8-bit SHIFT REGISTER, output latch DATASHEET <parts/ICs/sn74hc595>; DISTRIBUTOR: Digikey; DISTRIBUTORPARTNO: 296-14857-1-ND; MANPARTNO: SN74HC595DR; MANUFACTURER: Texas Instruments; MNT-TYPE: SM; NO-PINS: 16; PACKAGE: 16 SOIC
U10 = ciuffoIC:ATMEGA48A: ATMEGA48A microcontroller; DISTRIBUTOR: Digikey; DISTRIBUTORPARTNO: ATMEGA48V-10AU-ND; MANPARTNO: ATMEGA48V-10AU; MANUFACTURER: Atmel; MNT-TYPE: SM; NO-PINS: 32; PACKAGE: TQFP-32
U11 U12 = ciuffoIC:74*14: Hex schmitt trigger INVERTER; DISTRIBUTOR: Digikey; DISTRIBUTORPARTNO: 296-9179-1-ND; MANPARTNO: CD74HC14M96; MANUFACTURER: Texas Instruments; MNT-TYPE: TH; NO-PINS: 14; PACKAGE: 14 SOIC
U13 = ciuffoIC:74*138: 3-line to 8-line DECODER/DEMULTIPLEXER; DISTRIBUTOR: Digikey; DISTRIBUTORPARTNO: MC74HC138ADGOS-ND; MANPARTNO: MC74HC138ADG; MANUFACTURER: ON Semiconductor; MNT-TYPE: SM; NO-PINS: 16; PACKAGE: 16 SOIC
X1 = ciuffomisc:XTAL